# Altium schematic sheet STM32F7_BaseBoard.SchDoc: STM32F7 BASE BOARD
size A3; SheetSize: A4
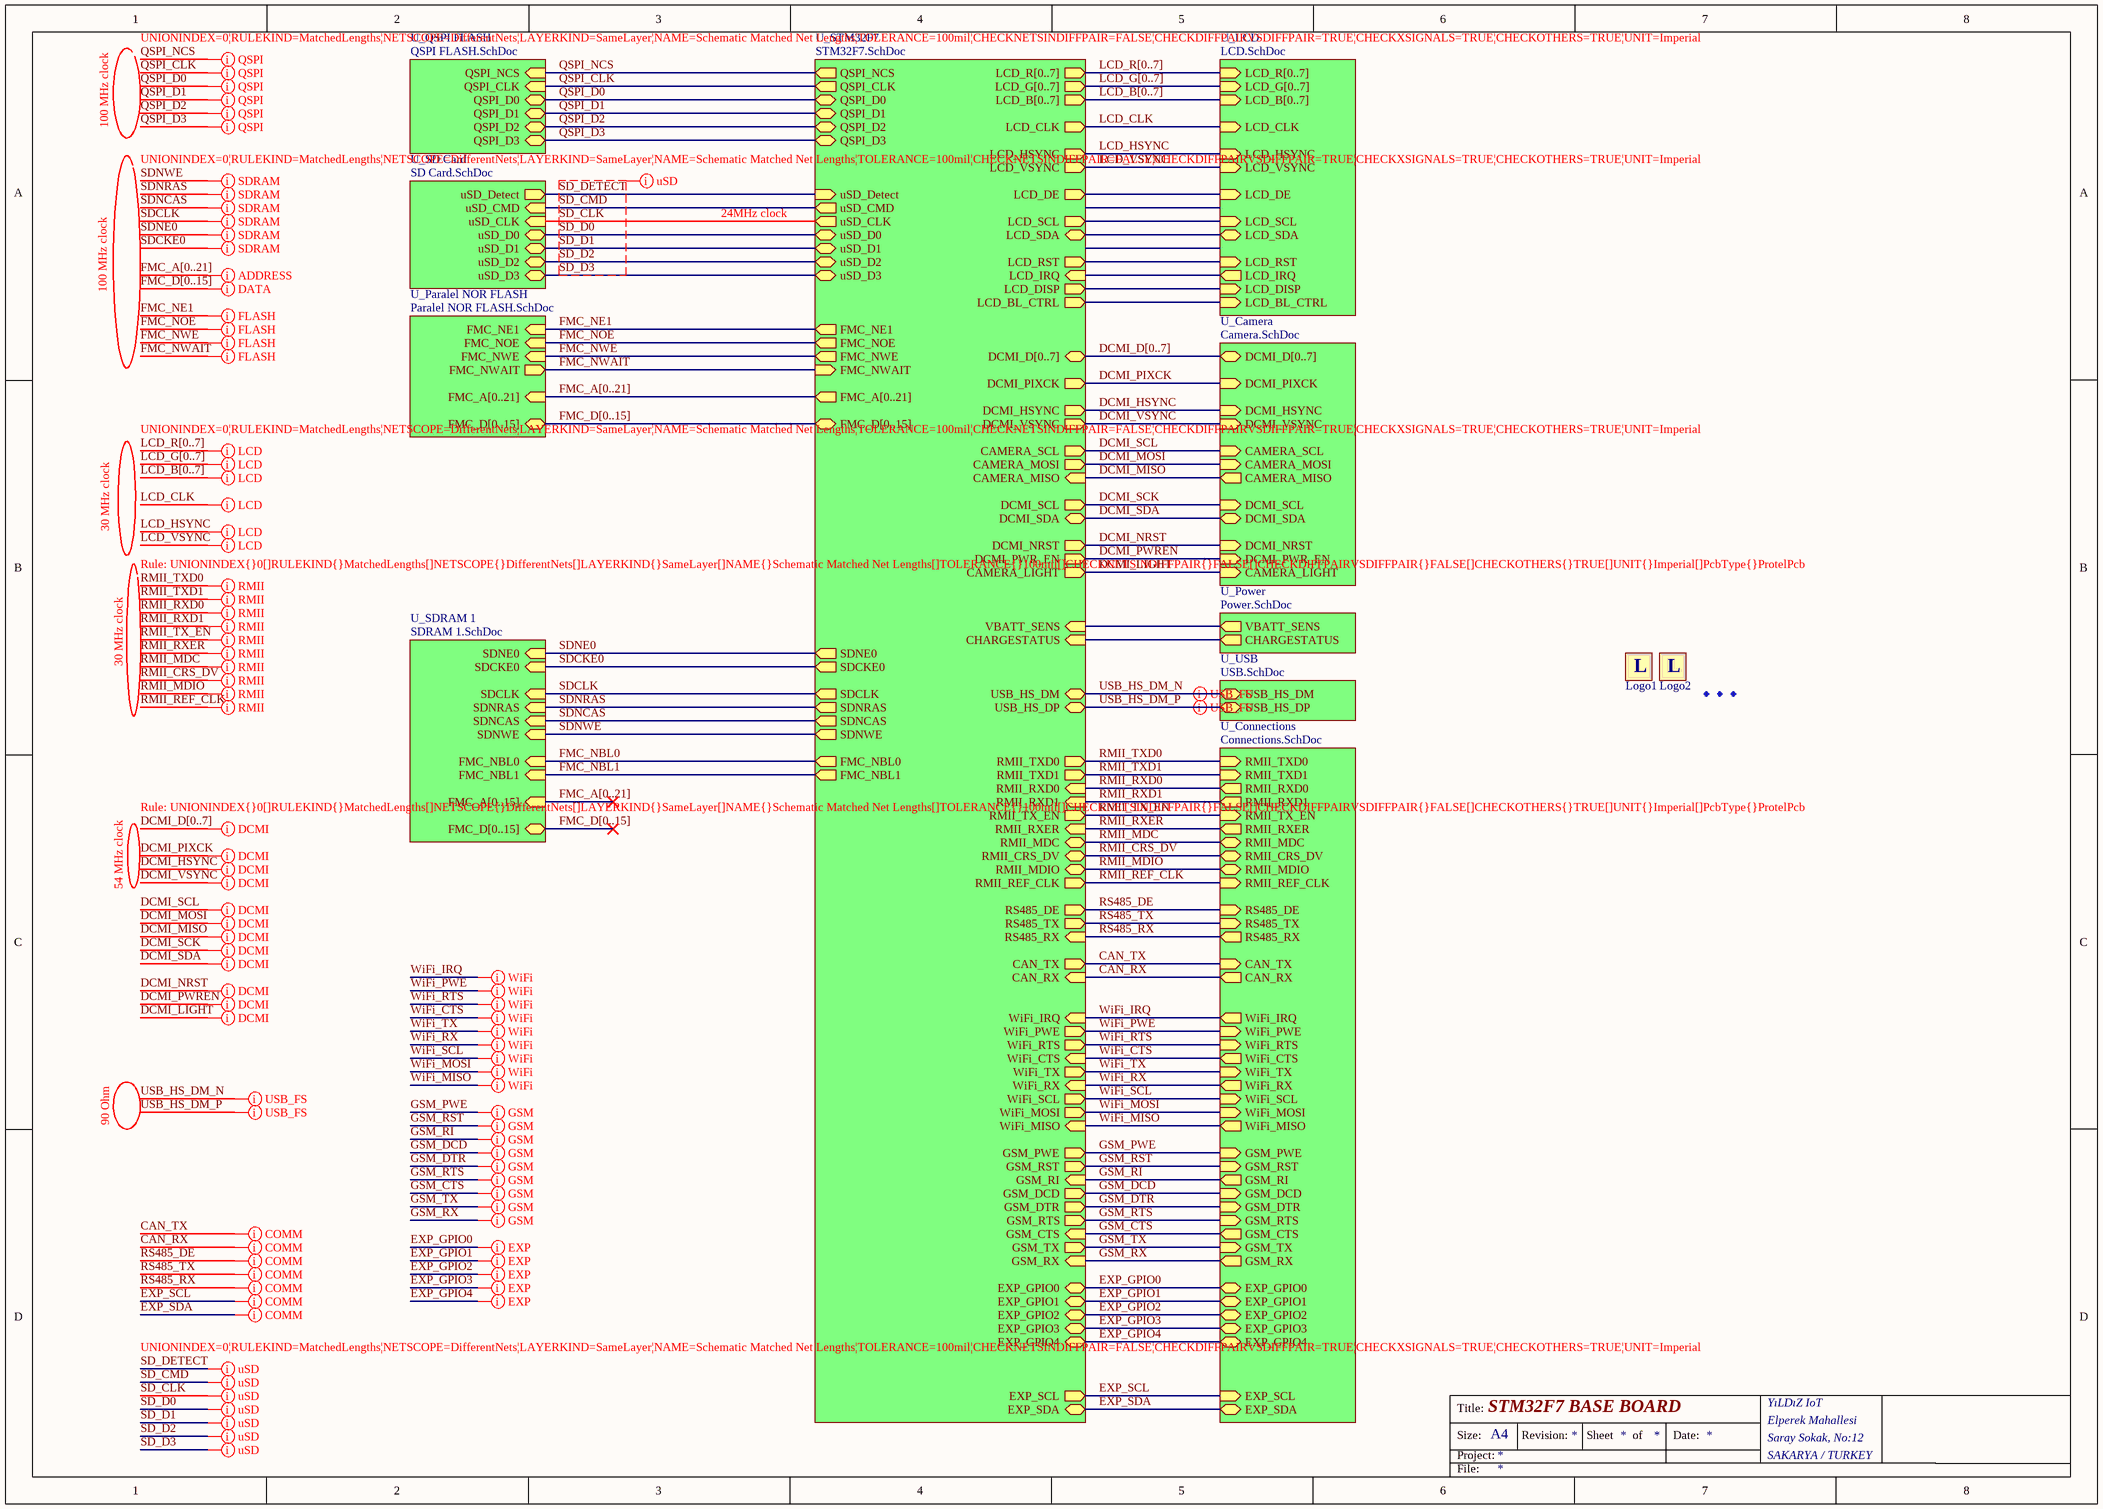
[diagram p0: STM32F7_BaseBoard.SchDoc]

## Parts
Fid1  Fiducial mark  [Fiducial]  (value not drawn)  (no BOM)
Fid2  Fiducial mark  [Fiducial]  (value not drawn)  (no BOM)
Fid3  Fiducial mark  [Fiducial]  (value not drawn)  (no BOM)
Logo1  Logo symbol  [LOGO_YILDIZIOT]  (value not drawn)  (no BOM)
Logo2  Logo symbol  [LOGO_YILDIZIOT]  (value not drawn)  (no BOM)

## Sub-sheets
U_Camera = Camera.SchDoc: DCMI_NRST (in), DCMI_D[0..7] (bidir), DCMI_PWR_EN (in), DCMI_VSYNC (in), DCMI_HSYNC (in), DCMI_PIXCK (in), DCMI_SDA (bidir), DCMI_SCL (in), CAMERA_SCL (in), CAMERA_MISO (out), CAMERA_MOSI (in), CAMERA_LIGHT (in)
U_Connections = Connections.SchDoc: RMII_TXD0 (in), RMII_TX_EN (in), RMII_TXD1 (in), RMII_RXD1 (out), RMII_RXER (out), RMII_MDC (bidir), RMII_REF_CLK (in), RMII_MDIO (bidir), GSM_RX (out), GSM_TX (in), GSM_RTS (in), GSM_CTS (out), GSM_DCD (in), GSM_DTR (in), GSM_RI (out), GSM_RST (in), GSM_PWE (in), WiFi_RX (out), WiFi_TX (in), WiFi_RTS (in), WiFi_CTS (out), RMII_CRS_DV (bidir), RMII_RXD0 (out), WiFi_SCL (in), WiFi_MISO (out), WiFi_MOSI (in), WiFi_PWE (in), RS485_TX (in), EXP_GPIO0 (bidir), RS485_RX (out), RS485_DE (in), EXP_GPIO2 (bidir), EXP_GPIO1 (bidir), CAN_RX (out), CAN_TX (in), EXP_SDA (bidir), EXP_SCL (in), EXP_GPIO3 (bidir), EXP_GPIO4 (bidir), WiFi_IRQ (out)
U_LCD = LCD.SchDoc: LCD_BL_CTRL (in), LCD_HSYNC (in), LCD_CLK (in), LCD_VSYNC (in), LCD_DISP (in), LCD_DE (in), LCD_RST (in), LCD_IRQ (out), LCD_SDA (bidir), LCD_SCL (in), LCD_B[0..7] (in), LCD_G[0..7] (in), LCD_R[0..7] (in)
U_Paralel NOR FLASH = Paralel NOR FLASH.SchDoc: FMC_D[0..15] (bidir), FMC_A[0..21] (in), FMC_NWE (in), FMC_NOE (in), FMC_NWAIT (out), FMC_NE1 (in)
U_Power = Power.SchDoc: VBATT_SENS (out), CHARGESTATUS (out)
U_QSPI FLASH = QSPI FLASH.SchDoc: QSPI_NCS (in), QSPI_CLK (in), QSPI_D0 (bidir), QSPI_D1 (bidir), QSPI_D2 (bidir), QSPI_D3 (bidir)
U_SD Card = SD Card.SchDoc: uSD_CMD (in), uSD_CLK (in), uSD_D0 (bidir), uSD_D1 (bidir), uSD_D2 (bidir), uSD_D3 (bidir), uSD_Detect (out)
U_SDRAM 1 = SDRAM 1.SchDoc: FMC_A[0..15] (in), FMC_D[0..15] (bidir), SDNWE (in), SDNCAS (in), SDNRAS (in), SDNE0 (in), SDCKE0 (in), SDCLK (in), FMC_NBL0 (in), FMC_NBL1 (in)
U_STM32F7 = STM32F7.SchDoc: QSPI_D0 (bidir), QSPI_D3 (bidir), QSPI_D2 (bidir), QSPI_D1 (bidir), QSPI_CLK (out), QSPI_NCS (out), FMC_D[0..15] (bidir), FMC_A[0..21] (out), FMC_NWE (out), FMC_NOE (out), FMC_NWAIT (in), FMC_NE1 (out), FMC_NBL0 (out), FMC_NBL1 (out), SDNCAS (out), SDNRAS (out), SDNE0 (out), SDCKE0 (out), SDCLK (out), LCD_BL_CTRL (out), LCD_HSYNC (out), LCD_CLK (out), LCD_VSYNC (out), LCD_DISP (out), LCD_DE (out), LCD_RST (out), LCD_IRQ (in), LCD_SDA (bidir), LCD_SCL (out), LCD_R[0..7] (out), LCD_G[0..7] (out), LCD_B[0..7] (out), DCMI_NRST (out), DCMI_D[0..7] (bidir), DCMI_PWR_EN (out), DCMI_VSYNC (out), DCMI_HSYNC (out), DCMI_PIXCK (out), DCMI_SDA (bidir), DCMI_SCL (out), CAMERA_SCL (out), CAMERA_MISO (in), CAMERA_MOSI (out), CAMERA_LIGHT (out), uSD_CMD (out), uSD_CLK (out), uSD_D0 (bidir), uSD_D1 (bidir), uSD_D2 (bidir), uSD_D3 (bidir), uSD_Detect (in), USB_HS_DM (bidir), USB_HS_DP (bidir), GSM_RX (in), GSM_TX (out), GSM_RTS (out), GSM_CTS (in), GSM_DCD (out), GSM_DTR (out), GSM_RI (in), GSM_RST (out), WiFi_PWE (out), GSM_PWE (out), WiFi_RX (in), WiFi_TX (out), WiFi_RTS (out), WiFi_CTS (in), WiFi_SCL (out), WiFi_MISO (in), WiFi_MOSI (out), RMII_TXD0 (out), RMII_TX_EN (out), RMII_TXD1 (out), RMII_RXD1 (in), RMII_RXER (in), RMII_MDC (bidir), RMII_REF_CLK (out), RMII_MDIO (bidir), RMII_CRS_DV (bidir), RMII_RXD0 (in), VBATT_SENS (in), RS485_DE (out), RS485_TX (out), RS485_RX (in), CAN_RX (in), CAN_TX (out), EXP_GPIO0 (bidir), EXP_GPIO1 (bidir), EXP_GPIO2 (bidir), CHARGESTATUS (in), EXP_SDA (bidir), EXP_SCL (out), SDNWE (out), EXP_GPIO3 (bidir), EXP_GPIO4 (bidir), WiFi_IRQ (in)
U_USB = USB.SchDoc: USB_HS_DM (bidir), USB_HS_DP (bidir)

## Nets
CAN_RX: sheet U_Connections/CAN_RX, sheet U_STM32F7/CAN_RX
CAN_TX: sheet U_Connections/CAN_TX, sheet U_STM32F7/CAN_TX
DCMI_HSYNC: sheet U_Camera/DCMI_HSYNC, sheet U_STM32F7/DCMI_HSYNC
DCMI_LIGHT: sheet U_Camera/CAMERA_LIGHT, sheet U_STM32F7/CAMERA_LIGHT
DCMI_MISO: sheet U_Camera/CAMERA_MISO, sheet U_STM32F7/CAMERA_MISO
DCMI_MOSI: sheet U_Camera/CAMERA_MOSI, sheet U_STM32F7/CAMERA_MOSI
DCMI_NRST: sheet U_Camera/DCMI_NRST, sheet U_STM32F7/DCMI_NRST
DCMI_PIXCK: sheet U_Camera/DCMI_PIXCK, sheet U_STM32F7/DCMI_PIXCK
DCMI_PWREN: sheet U_Camera/DCMI_PWR_EN, sheet U_STM32F7/DCMI_PWR_EN
DCMI_SCK: sheet U_Camera/DCMI_SCL, sheet U_STM32F7/DCMI_SCL
DCMI_SCL: sheet U_Camera/CAMERA_SCL, sheet U_STM32F7/CAMERA_SCL
DCMI_SDA: sheet U_Camera/DCMI_SDA, sheet U_STM32F7/DCMI_SDA
DCMI_VSYNC: sheet U_Camera/DCMI_VSYNC, sheet U_STM32F7/DCMI_VSYNC
EXP_GPIO0: sheet U_Connections/EXP_GPIO0, sheet U_STM32F7/EXP_GPIO0
EXP_GPIO1: sheet U_Connections/EXP_GPIO1, sheet U_STM32F7/EXP_GPIO1
EXP_GPIO2: sheet U_Connections/EXP_GPIO2, sheet U_STM32F7/EXP_GPIO2
EXP_GPIO3: sheet U_Connections/EXP_GPIO3, sheet U_STM32F7/EXP_GPIO3
EXP_GPIO4: sheet U_Connections/EXP_GPIO4, sheet U_STM32F7/EXP_GPIO4
EXP_SCL: sheet U_Connections/EXP_SCL, sheet U_STM32F7/EXP_SCL
EXP_SDA: sheet U_Connections/EXP_SDA, sheet U_STM32F7/EXP_SDA
FMC_NBL0: sheet U_SDRAM 1/FMC_NBL0, sheet U_STM32F7/FMC_NBL0
FMC_NBL1: sheet U_SDRAM 1/FMC_NBL1, sheet U_STM32F7/FMC_NBL1
FMC_NE1: sheet U_Paralel NOR FLASH/FMC_NE1, sheet U_STM32F7/FMC_NE1
FMC_NOE: sheet U_Paralel NOR FLASH/FMC_NOE, sheet U_STM32F7/FMC_NOE
FMC_NWAIT: sheet U_Paralel NOR FLASH/FMC_NWAIT, sheet U_STM32F7/FMC_NWAIT
FMC_NWE: sheet U_Paralel NOR FLASH/FMC_NWE, sheet U_STM32F7/FMC_NWE
GSM_CTS: sheet U_Connections/GSM_CTS, sheet U_STM32F7/GSM_CTS
GSM_DCD: sheet U_Connections/GSM_DCD, sheet U_STM32F7/GSM_DCD
GSM_DTR: sheet U_Connections/GSM_DTR, sheet U_STM32F7/GSM_DTR
GSM_PWE: sheet U_Connections/GSM_PWE, sheet U_STM32F7/GSM_PWE
GSM_RI: sheet U_Connections/GSM_RI, sheet U_STM32F7/GSM_RI
GSM_RST: sheet U_Connections/GSM_RST, sheet U_STM32F7/GSM_RST
GSM_RTS: sheet U_Connections/GSM_RTS, sheet U_STM32F7/GSM_RTS
GSM_RX: sheet U_Connections/GSM_RX, sheet U_STM32F7/GSM_RX
GSM_TX: sheet U_Connections/GSM_TX, sheet U_STM32F7/GSM_TX
LCD_CLK: sheet U_STM32F7/LCD_CLK, sheet U_LCD/LCD_CLK
LCD_HSYNC: sheet U_STM32F7/LCD_HSYNC, sheet U_LCD/LCD_HSYNC
LCD_VSYNC: sheet U_STM32F7/LCD_VSYNC, sheet U_LCD/LCD_VSYNC
QSPI_CLK: sheet U_QSPI FLASH/QSPI_CLK, sheet U_STM32F7/QSPI_CLK
QSPI_D0: sheet U_QSPI FLASH/QSPI_D0, sheet U_STM32F7/QSPI_D0
QSPI_D1: sheet U_QSPI FLASH/QSPI_D1, sheet U_STM32F7/QSPI_D1
QSPI_D2: sheet U_QSPI FLASH/QSPI_D2, sheet U_STM32F7/QSPI_D2
QSPI_D3: sheet U_QSPI FLASH/QSPI_D3, sheet U_STM32F7/QSPI_D3
QSPI_NCS: sheet U_QSPI FLASH/QSPI_NCS, sheet U_STM32F7/QSPI_NCS
RMII_CRS_DV: sheet U_Connections/RMII_CRS_DV, sheet U_STM32F7/RMII_CRS_DV
RMII_MDC: sheet U_Connections/RMII_MDC, sheet U_STM32F7/RMII_MDC
RMII_MDIO: sheet U_Connections/RMII_MDIO, sheet U_STM32F7/RMII_MDIO
RMII_REF_CLK: sheet U_Connections/RMII_REF_CLK, sheet U_STM32F7/RMII_REF_CLK
RMII_RXD0: sheet U_Connections/RMII_RXD0, sheet U_STM32F7/RMII_RXD0
RMII_RXD1: sheet U_Connections/RMII_RXD1, sheet U_STM32F7/RMII_RXD1
RMII_RXER: sheet U_Connections/RMII_RXER, sheet U_STM32F7/RMII_RXER
RMII_TX_EN: sheet U_Connections/RMII_TX_EN, sheet U_STM32F7/RMII_TX_EN
RMII_TXD0: sheet U_Connections/RMII_TXD0, sheet U_STM32F7/RMII_TXD0
RMII_TXD1: sheet U_Connections/RMII_TXD1, sheet U_STM32F7/RMII_TXD1
RS485_DE: sheet U_Connections/RS485_DE, sheet U_STM32F7/RS485_DE
RS485_RX: sheet U_Connections/RS485_RX, sheet U_STM32F7/RS485_RX
RS485_TX: sheet U_Connections/RS485_TX, sheet U_STM32F7/RS485_TX
SD_CLK: sheet U_STM32F7/uSD_CLK, sheet U_SD Card/uSD_CLK
SD_CMD: sheet U_STM32F7/uSD_CMD, sheet U_SD Card/uSD_CMD
SD_D0: sheet U_STM32F7/uSD_D0, sheet U_SD Card/uSD_D0
SD_D1: sheet U_STM32F7/uSD_D1, sheet U_SD Card/uSD_D1
SD_D2: sheet U_STM32F7/uSD_D2, sheet U_SD Card/uSD_D2
SD_D3: sheet U_STM32F7/uSD_D3, sheet U_SD Card/uSD_D3
SD_DETECT: sheet U_STM32F7/uSD_Detect, sheet U_SD Card/uSD_Detect
SDCKE0: sheet U_SDRAM 1/SDCKE0, sheet U_STM32F7/SDCKE0
SDCLK: sheet U_SDRAM 1/SDCLK, sheet U_STM32F7/SDCLK
SDNCAS: sheet U_SDRAM 1/SDNCAS, sheet U_STM32F7/SDNCAS
SDNE0: sheet U_SDRAM 1/SDNE0, sheet U_STM32F7/SDNE0
SDNRAS: sheet U_SDRAM 1/SDNRAS, sheet U_STM32F7/SDNRAS
SDNWE: sheet U_SDRAM 1/SDNWE, sheet U_STM32F7/SDNWE
USB_HS_DM_N: sheet U_STM32F7/USB_HS_DM, sheet U_USB/USB_HS_DM
USB_HS_DM_P: sheet U_STM32F7/USB_HS_DP, sheet U_USB/USB_HS_DP
WiFi_CTS: sheet U_Connections/WiFi_CTS, sheet U_STM32F7/WiFi_CTS
WiFi_IRQ: sheet U_Connections/WiFi_IRQ, sheet U_STM32F7/WiFi_IRQ
WiFi_MISO: sheet U_Connections/WiFi_MISO, sheet U_STM32F7/WiFi_MISO
WiFi_MOSI: sheet U_Connections/WiFi_MOSI, sheet U_STM32F7/WiFi_MOSI
WiFi_PWE: sheet U_Connections/WiFi_PWE, sheet U_STM32F7/WiFi_PWE
WiFi_RTS: sheet U_Connections/WiFi_RTS, sheet U_STM32F7/WiFi_RTS
WiFi_RX: sheet U_Connections/WiFi_RX, sheet U_STM32F7/WiFi_RX
WiFi_SCL: sheet U_Connections/WiFi_SCL, sheet U_STM32F7/WiFi_SCL
WiFi_TX: sheet U_Connections/WiFi_TX, sheet U_STM32F7/WiFi_TX
(unnamed): sheet U_Power/VBATT_SENS, sheet U_STM32F7/VBATT_SENS
(unnamed): sheet U_Power/CHARGESTATUS, sheet U_STM32F7/CHARGESTATUS
(unnamed): sheet U_STM32F7/LCD_BL_CTRL, sheet U_LCD/LCD_BL_CTRL
(unnamed): sheet U_STM32F7/LCD_DISP, sheet U_LCD/LCD_DISP
(unnamed): sheet U_STM32F7/LCD_DE, sheet U_LCD/LCD_DE
(unnamed): sheet U_STM32F7/LCD_RST, sheet U_LCD/LCD_RST
(unnamed): sheet U_STM32F7/LCD_IRQ, sheet U_LCD/LCD_IRQ
(unnamed): sheet U_STM32F7/LCD_SDA, sheet U_LCD/LCD_SDA
(unnamed): sheet U_STM32F7/LCD_SCL, sheet U_LCD/LCD_SCL

## Buses and harness runs
bus DCMI_D[0..7]
bus DCMI_D[0..7] = sheet U_Camera/DCMI_D[0..7] = sheet U_STM32F7/DCMI_D[0..7]
bus FMC_A[0..21]
bus FMC_A[0..21] = sheet U_Paralel NOR FLASH/FMC_A[0..21] = sheet U_STM32F7/FMC_A[0..21]
bus FMC_A[0..21] = sheet U_SDRAM 1/FMC_A[0..15]
bus FMC_D[0..15]
bus FMC_D[0..15] = sheet U_Paralel NOR FLASH/FMC_D[0..15] = sheet U_STM32F7/FMC_D[0..15]
bus FMC_D[0..15] = sheet U_SDRAM 1/FMC_D[0..15]
bus LCD_B[0..7]
bus LCD_B[0..7] = sheet U_LCD/LCD_B[0..7] = sheet U_STM32F7/LCD_B[0..7]
bus LCD_G[0..7]
bus LCD_G[0..7] = sheet U_LCD/LCD_G[0..7] = sheet U_STM32F7/LCD_G[0..7]
bus LCD_R[0..7]
bus LCD_R[0..7] = sheet U_LCD/LCD_R[0..7] = sheet U_STM32F7/LCD_R[0..7]

## Layout directives
net class QSPI; rule Matched Net Lengths [Tolerance = 100mil]: QSPI_CLK, QSPI_D0, QSPI_D1, QSPI_D2, QSPI_D3, QSPI_NCS
net class SDRAM; rule Matched Net Lengths [Tolerance = 100mil]: SDCKE0, SDCLK, SDNCAS, SDNE0, SDNRAS, SDNWE
net class ADDRESS; rule Matched Net Lengths [Tolerance = 100mil]: (no net found under the mark)
net class DATA; rule Matched Net Lengths [Tolerance = 100mil]: (no net found under the mark)
net class LCD; rule Matched Net Lengths [Tolerance = 100mil]: (no net found under the mark), LCD_CLK, LCD_HSYNC, LCD_VSYNC
rule Matched Net Lengths [Tolerance = 100mil]; net class ETHERNET: RMII_CRS_DV, RMII_MDC, RMII_MDIO, RMII_REF_CLK, RMII_RXD0, RMII_RXD1, RMII_RXER, RMII_TX_EN, RMII_TXD0, RMII_TXD1
rule Matched Net Lengths [Tolerance = 100mil]; net class DCMI: (no net found under the mark), DCMI_HSYNC, DCMI_PIXCK, DCMI_VSYNC
differential pair; differential pair class USB_FS: USB_HS_DM_N, USB_HS_DM_P
rule Matched Net Lengths [Tolerance = 100mil]; net class USB_FS: USB_HS_DM_N, USB_HS_DM_P
net class COMM: CAN_RX, CAN_TX, EXP_SCL, EXP_SDA, RS485_DE, RS485_RX, RS485_TX
net class FLASH; rule Matched Net Lengths [Tolerance = 100mil]: FMC_NE1, FMC_NOE, FMC_NWAIT, FMC_NWE
net class DCMI: DCMI_LIGHT, DCMI_MISO, DCMI_MOSI, DCMI_NRST, DCMI_PWREN, DCMI_SCK, DCMI_SCL, DCMI_SDA
net class uSD: SD_CLK, SD_CMD, SD_D0, SD_D1, SD_D2, SD_D3, SD_DETECT
net class uSD; rule Matched Net Lengths [Tolerance = 100mil]: SD_CLK, SD_CMD, SD_D0, SD_D1, SD_D2, SD_D3, SD_DETECT
net class WiFi: WiFi_CTS, WiFi_IRQ, WiFi_MISO, WiFi_MOSI, WiFi_PWE, WiFi_RTS, WiFi_RX, WiFi_SCL, WiFi_TX
net class GSM: GSM_CTS, GSM_DCD, GSM_DTR, GSM_PWE, GSM_RI, GSM_RST, GSM_RTS, GSM_RX, GSM_TX
net class EXP: EXP_GPIO0, EXP_GPIO1, EXP_GPIO2, EXP_GPIO3, EXP_GPIO4

## Notes on the sheet
- 100 MHz clock
- 24MHz clock
- 30 MHz clock
- 54 MHz clock
- 90 Ohm
- Title:
- Size:
- Project:
- Revision:
- Sheet
- of
- Date:
- YıLDıZ IoT
- Elperek Mahallesi
- Saray Sokak, No:12
- SAKARYA / TURKEY
- File:
- (in symbol Logo) L

## Library data of the parts
Fid1-Fid3 = Fiducial: Part Number: Fid-Mark; Artikkelnr Noca: N.A.; Manufacturer: *; Manufacturer Part Number: *; Datasheet: *; LatestRevisionDate: 2009-12-12; Pin Count: 1; Publisher: Nordic Semiconductor; Published: 2009-12-12; Value: *; Note: *; Supplier: *; Supplier part number: *; 2nd source Supplier: *; 2nd source part number: *; Footprint Doc: Fiducial; Artikkelnr Simpro: N.A.
Logo1 Logo2 = Logo: Schematic symbol for Logo